# EAGLE design antares (EAGLE 4.16)
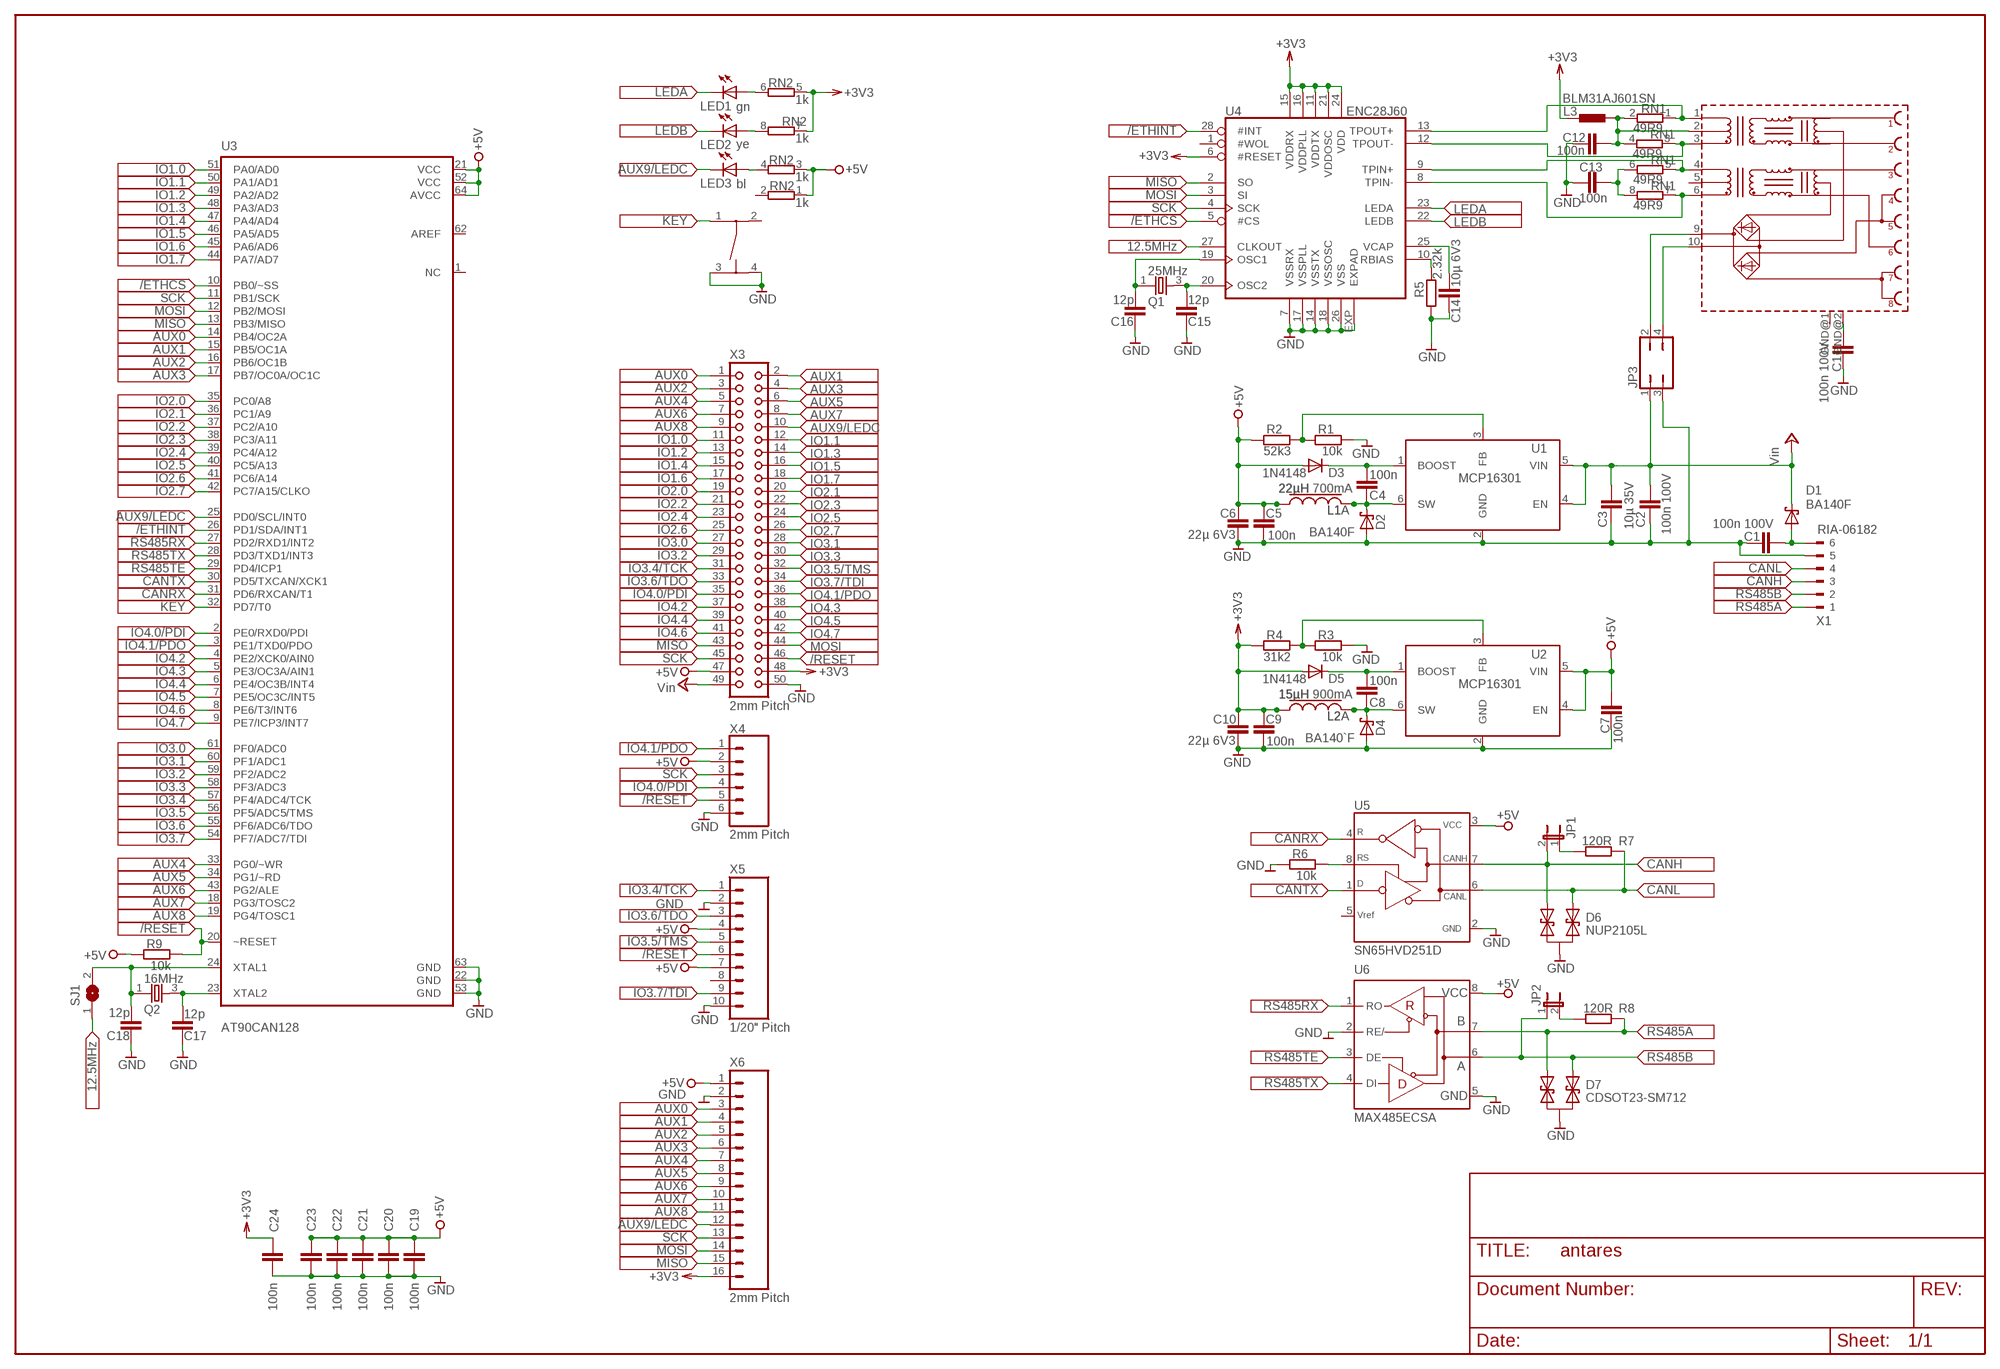
[diagram p0: schematic, sheet 1]

## Parts
C1  100n 100V  C-EUC1206  [C1206]
C2  100n 100V  C-EUC1206  [C1206]
C3  10µ 35V  C-EUC1210  [C1210]
C4  100n  C-EUC0603  [C0603]
C5  100n  C-EUC0603  [C0603]
C6  22µ 6V3  C-EUC0805  [C0805]
C7  100n  C-EUC0603  [C0603]
C8  100n  C-EUC0603  [C0603]
C9  100n  C-EUC0603  [C0603]
C10  22µ 6V3  C-EUC0805  [C0805]
C11  100n 100V  C-EUC1206  [C1206]
C12  100n  C-EUC0603  [C0603]
C13  100n  C-EUC0603  [C0603]
C14  10µ 6V3  C-EUC0603  [C0603]
C15  12p  C-EUC0603  [C0603]
C16  12p  C-EUC0603  [C0603]
C17  12p  C-EUC0603  [C0603]
C18  12p  C-EUC0603  [C0603]
C19  100n  C-EUC0603  [C0603]
C20  100n  C-EUC0603  [C0603]
C21  100n  C-EUC0603  [C0603]
C22  100n  C-EUC0603  [C0603]
C23  100n  C-EUC0603  [C0603]
C24  100n  C-EUC0603  [C0603]
D1  BA140F  SCHOTTKY-DIODESMA  [SMA]
D2  BA140F  SCHOTTKY-DIODESMA  [SMA]
D3  1N4148  DIODE-SOD323-R  [SOD323-R]
D4  BA140`F  SCHOTTKY-DIODESMA  [SMA]
D5  1N4148  DIODE-SOD323-R  [SOD323-R]
D6  NUP2105L  [SOT23]
D7  CDSOT23-SM712  NUP2105L  [SOT23]
JP1  JP1EI  [JP1]
JP2  JP1EI  [JP1]
JP3  JP2Q  [JP2Q]
L1  22µH 700mA  PISG  [PISG]
L1A  22µH  SRN3015  [SRN3015]
L2  15µH 900mA  PISG  [PISG]
L2A  15µH  SRN3015  [SRN3015]
L3  BLM31AJ601SN  L-EUL1206  [C1206K]
LED1  gn  LEDCHIP-LED0805  [CHIP-LED0805]
LED2  ye  LEDCHIP-LED0805  [CHIP-LED0805]
LED3  bl  LEDCHIP-LED0805  [CHIP-LED0805]
Q1  25MHz  QXO32  [XO32]
Q2  16MHz  QXO32  [XO32]
R1  10k  R-EU_R0603  [R0603]
R2  52k3  R-EU_R0603  [R0603]
R3  10k  R-EU_R0603  [R0603]
R4  31k2  R-EU_R0603  [R0603]
R5  2.32k  R-EU_R0603  [R0603]
R6  10k  R-EU_R0603  [R0603]
R7  120R  R-EU_R0603  [R0603]
R8  120R  R-EU_R0603  [R0603]
R9  10k  R-EU_R0603  [R0603]
RN1  49R9  E4RP  [BCN16]
RN2  1k  E4RP  [BCN16]
SJ1  SJN  [SJJ]
SW1  MENTOR1254PHAP3301  [PHAP3301]
U1  MCP16301  [SOT23-6L]
U2  MCP16301  [SOT23-6L]
U3  AT90CAN128  AT90CAN16AU  [TQFP64]
U4  ENC28J60  ENC28J60I/ML  [QNF28]
U5  SN65HVD251D  SN65HVD230DESA  [SO8]
U6  MAX485ECSA  MAX3072ECSA  [SO8]
X1  RIA-06182  [182-06]
X2  WE7499210001A-  [WE7499210001A]
X3  2mm Pitch  CON50F  [2MM-50DF]
X4  2mm Pitch  ML6M  [STL22-560LPGGG6]
X5  1/20" Pitch  ML1012C56  [12C56-010G]
X6  2mm Pitch  ML16STL560  [STL22-560LPGGG16]

## Nets
12.5MHZ: SJ1.1 U4.27(CLKOUT)
+3V3: C9.2 C10.2 C24.2 D5.A L2.2 L2A.1 L3.1 R4.2 RN2.5 RN2.7 U4.6(#RESET) U4.11(VDDTX) U4.15(VDDRX) U4.16(VDDPLL) U4.21(VDDOSC) U4.24(VDD) X3.48 X6.16
+5V [gnd-vcc]: C5.2 C6.2 C7.2 C19.2 C20.2 C21.2 C22.2 C23.2 D3.A L1.2 L1A.1 R2.2 R9.2 RN2.1 RN2.3 U2.4(EN) U2.5(VIN) U3.21(VCC) U3.52(VCC) U3.64(AVCC) U5.3(VCC) U6.8(VCC) X3.47 X4.2 X5.4 X5.7 X6.1
/ETHCS: U3.10(PB0/~SS) U4.5(#CS)
/ETHINT: U3.26(PD1/SDA/INT1) U4.28(#INT)
/RESET: R9.1 U3.20(~RESET) X3.46 X4.5 X5.6
AUX0: U3.14(PB4/OC2A) X3.1 X6.3
AUX1: U3.15(PB5/OC1A) X3.2 X6.4
AUX2: U3.16(PB6/OC1B) X3.3 X6.5
AUX3: U3.17(PB7/OC0A/OC1C) X3.4 X6.6
AUX4: U3.33(PG0/~WR) X3.5 X6.7
AUX5: U3.34(PG1/~RD) X3.6 X6.8
AUX6: U3.43(PG2/ALE) X3.7 X6.9
AUX7: U3.18(PG3/TOSC2) X3.8 X6.10
AUX8: U3.19(PG4/TOSC1) X3.9 X6.11
AUX9/LEDC: LED3.C U3.25(PD0/SCL/INT0) X3.10 X6.12
BST3: C8.2 D5.C U2.1(BOOST)
BST5: C4.2 D3.C U1.1(BOOST)
CANH: D6.1 JP1.2 U5.7(CANH) X1.3
CANL: D6.2 R7.2 U5.6(CANL) X1.4
CANRX: U3.31(PD6/RXCAN/T1) U5.4(R)
CANTX: U3.30(PD5/TXCAN/XCK1) U5.1(D)
FB3: R3.2 R4.1 U2.3(FB)
FB5: R1.2 R2.1 U1.3(FB)
GND: C1.1 C2.2 C3.1 C5.1 C6.1 C7.1 C9.1 C10.1 C11.1 C12.1 C13.1 C14.1 C15.1 C16.1 C17.1 C18.1 C19.1 C20.1 C21.1 C22.1 C23.1 C24.1 D2.A D4.A D6.3 D7.3 JP3.3 R1.1 R3.1 R5.1 R6.2 SW1.3(A) SW1.4(A) U1.2(GND) U2.2(GND) U3.22(GND) U3.53(GND) U3.63(GND) U4.7(VSSRX) U4.14(VSSTX) U4.17(VSSPLL) U4.18(VSSOSC) U4.26(VSS) U4.EXP(EXPAD) U5.2(GND) U6.2(RE/) U6.5(GND) X1.5 X3.50 X4.6 X5.2 X5.10 X6.2
IO1.0: U3.51(PA0/AD0) X3.11
IO1.1: U3.50(PA1/AD1) X3.12
IO1.2: U3.49(PA2/AD2) X3.13
IO1.3: U3.48(PA3/AD3) X3.14
IO1.4: U3.47(PA4/AD4) X3.15
IO1.5: U3.46(PA5/AD5) X3.16
IO1.6: U3.45(PA6/AD6) X3.17
IO1.7: U3.44(PA7/AD7) X3.18
IO2.0: U3.35(PC0/A8) X3.19
IO2.1: U3.36(PC1/A9) X3.20
IO2.2: U3.37(PC2/A10) X3.21
IO2.3: U3.38(PC3/A11) X3.22
IO2.4: U3.39(PC4/A12) X3.23
IO2.5: U3.40(PC5/A13) X3.24
IO2.6: U3.41(PC6/A14) X3.25
IO2.7: U3.42(PC7/A15/CLKO) X3.26
IO3.0: U3.61(PF0/ADC0) X3.27
IO3.1: U3.60(PF1/ADC1) X3.28
IO3.2: U3.59(PF2/ADC2) X3.29
IO3.3: U3.58(PF3/ADC3) X3.30
IO3.4/TCK: U3.57(PF4/ADC4/TCK) X3.31 X5.1
IO3.5/TMS: U3.56(PF5/ADC5/TMS) X3.32 X5.5
IO3.6/TDO: U3.55(PF6/ADC6/TDO) X3.33 X5.3
IO3.7/TDI: U3.54(PF7/ADC7/TDI) X3.34 X5.9
IO4.0/PDI: U3.2(PE0/RXD0/PDI) X3.35 X4.4
IO4.1/PDO: U3.3(PE1/TXD0/PDO) X3.36 X4.1
IO4.2: U3.4(PE2/XCK0/AIN0) X3.37
IO4.3: U3.5(PE3/OC3A/AIN1) X3.38
IO4.4: U3.6(PE4/OC3B/INT4) X3.39
IO4.5: U3.7(PE5/OC3C/INT5) X3.40
IO4.6: U3.8(PE6/T3/INT6) X3.41
IO4.7: U3.9(PE7/ICP3/INT7) X3.42
KEY: SW1.1(B) U3.32(PD7/T0)
LEDA: LED1.C U4.23(LEDA)
LEDB: LED2.C U4.22(LEDB)
MISO: U3.13(PB3/MISO) U4.2(SO) X3.43 X6.15
MOSI: U3.12(PB2/MOSI) U4.3(SI) X3.44 X6.14
N$4: LED3.A RN2.4
N$7: C12.2 L3.2 RN1.2 RN1.4 X2.2(TCT)
N$8: C13.2 RN1.6 RN1.8
N$23: R6.1 U5.8(RS)
N$24: JP1.1 R7.1
N$25: LED1.A RN2.6
N$26: JP2.2 R8.1
N$29: LED2.A RN2.8
OSC1: C16.2 Q1.1 U4.19(OSC1)
OSC2: C15.2 Q1.3 U4.20(OSC2)
RBIAS: R5.2 U4.10(RBIAS)
RS485A: D7.1 R8.2 U6.7(B) X1.1
RS485B: D7.2 JP2.1 U6.6(A) X1.2
RS485RX: U3.27(PD2/RXD1/INT2) U6.1(RO)
RS485TE: U3.29(PD4/ICP1) U6.3(DE)
RS485TX: U3.28(PD3/TXD1/INT3) U6.4(DI)
SCK: U3.11(PB1/SCK) U4.4(SCK) X3.45 X4.3 X6.13
SHLD: C11.2 X2.GND@2(SHLD)
SW3: C8.1 D4.C L2.1 L2A.2 U2.6(SW)
SW5: C4.1 D2.C L1.1 L1A.2 U1.6(SW)
TPIN+: RN1.5 U4.9(TPIN+) X2.4(RX+)
TPIN-: RN1.7 U4.8(TPIN-) X2.6(RX-)
TPOUT+: RN1.1 U4.13(TPOUT+) X2.1(TX+)
TPOUT-: RN1.3 U4.12(TPOUT-) X2.3(TX-)
VCAP: C14.2 U4.25(VCAP)
VETH+: JP3.2 X2.9(VC1+)
VETH-: JP3.4 X2.10(VC1-)
VIN [power]: C2.1 C3.2 D1.C JP3.1 U1.4(EN) U1.5(VIN) X3.49 ; supply symbol labelled Vin
VSUP [power]: C1.2 D1.A X1.6
XTAL1: C18.2 Q2.1 SJ1.2 U3.24(XTAL1)
XTAL2: C17.2 Q2.3 U3.23(XTAL2)
Unconnected: RN2.2 SW1.2(B) U3.1(NC) U3.62(AREF) U4.1(#WOL) U5.5(VREF) X2.5(RCT) X2.GND@1(SHLD) X5.8

## Library data of the parts
C1-C24 = rcl:C-EU: CAPACITOR, European symbol
D1 D2 D4 = diode:SCHOTTKY-DIODE: Schottky Diode
D3 D5 = diode:DIODE-: DIODE
D6 D7 = _frank:NUP2105L
JP1 JP2 = jumper:JP1E: JUMPER
JP3 = jumper:JP2Q: JUMPER
L1 L2 = inductor-fastron:PI
L1A L2A = inductor-bourns:SRN
L3 = rcl:L-EU: INDUCTOR, European symbol
LED1-LED3 = led:LED: LED OSRAM: - CHIPLED LG R971, LG N971, LY N971, LG Q971, LY Q971, LO R971, LY R971 LH N974, LH R974 LS Q976, LO Q976, LY Q976 LO Q996 - Hyper CHIPLED LW Q18S LB Q993, LB Q99A, LB R99A - SideLED LS A670, LO A670, LY A670, LG A670, LP A670 LB A673, LV A673, LT A673, LW A673 LH A674 LY A675 LS A676, LA A676, LO A676, LY A676, LW A676 LS A679, LY A679, LG A679 - Hyper Micro SIDELED® LS Y876, LA Y876, LO Y876, LY Y876 LT Y87S - SmartLED LW L88C, LW L88S LB L89C, LB L89S, LG L890 LS L89K, LO L89K, LY L89K LS L896, LA L896, LO L896, LY L896 - TOPLED LS T670, LO T670, LY T670, LG T670, LP T670 LSG T670, LSP T670, LSY T670, LOP T670, LYG T670 LG T671, LOG T671, LSG T671 LB T673, LV T673, LT T673, LW T673 LH T674 LS T676, LA T676, LO T676, LY T676, LB T676, LH T676, LSB T676, LW T676 LB T67C, LV T67C, LT T67C, LS T67K, LO T67K, LY T67K, LW E67C LS E67B, LA E67B, LO E67B, LY E67B, LB E67C, LV E67C, LT E67C LW T67C LS T679, LY T679, LG T679 LS T770, LO T770, LY T770, LG T770, LP T770 LB T773, LV T773, LT T773, LW T773 LH T774 LS E675, LA E675, LY E675, LS T675 LS T776, LA T776, LO T776, LY T776, LB T776 LHGB T686 LT T68C, LB T68C - Hyper Mini TOPLED® LB M676 - Mini TOPLED Santana® LG M470 LS M47K, LO M47K, LY M47K Source: http://www.osram.convergy.de - LUMILED® LXK2-PW12-R00, LXK2-PW12-S00, LXK2-PW14-U00, LXK2-PW14-V00 LXK2-PM12-R00, LXK2-PM12-S00, LXK2-PM14-U00 LXK2-PE12-Q00, LXK2-PE12-R00, LXK2-PE12-S00, LXK2-PE14-T00, LXK2-PE14-U00 LXK2-PB12-K00, LXK2-PB12-L00, LXK2-PB12-M00, LXK2-PB14-N00, LXK2-PB14-P00, LXK2-PB14-Q00 LXK2-PR12-L00, LXK2-PR12-M00, LXK2-PR14-Q00, LXK2-PR14-R00 LXK2-PD12-Q00, LXK2-PD12-R00, LXK2-PD12-S00 LXK2-PH12-R00, LXK2-PH12-S00 LXK2-PL12-P00, LXK2-PL12-Q00, LXK2-PL12-R00 Source: www.luxeon.com
Q1 Q2 = _frank:Q: CRYSTAL
R1-R9 = rcl:R-EU_: RESISTOR, European symbol
RN1 RN2 = _frank:E4RP: SIL RESISTOR
SJ1 = jumper:SJ: SMD solder JUMPER
SW1 = switch:MENTOR1254
U1 U2 = _frank:MCP16301
U3 = AT90CAN:AT90CAN
U4 = ENC28J60:ENC28J60
U5 = _frank:SN65HVD230D: CANBUS TRANSEIVER
U6 = _frank:MAX3072E
X1 = con-ria:RIA-06
X2 = _frank:WE7499210001A
X3 = con-2mm-dual:CON50: CONNECTOR
X4 = con-harting-ml:ML6: HARTING
X5 = con-harting-ml:ML10: HARTING
X6 = con-harting-ml:ML16: HARTING

## Net classes
0 default: width 0.15 mm, drill 0.15 mm, clearance 0.3 mm
1 power: width 0.15 mm, drill 0.5 mm, clearance 0.3 mm
2 gnd-vcc: width 0.15 mm, drill 0.15 mm, clearance 0.3 mm

## Board
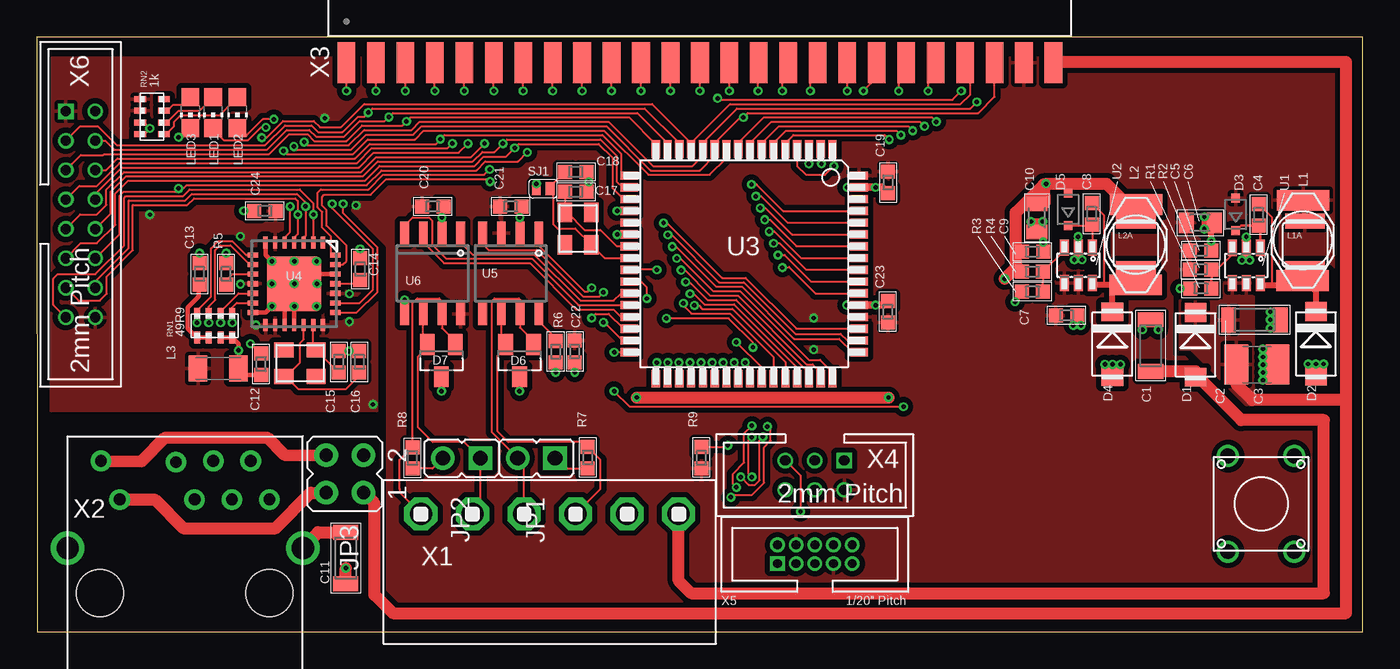
[diagram p1: board, top side]
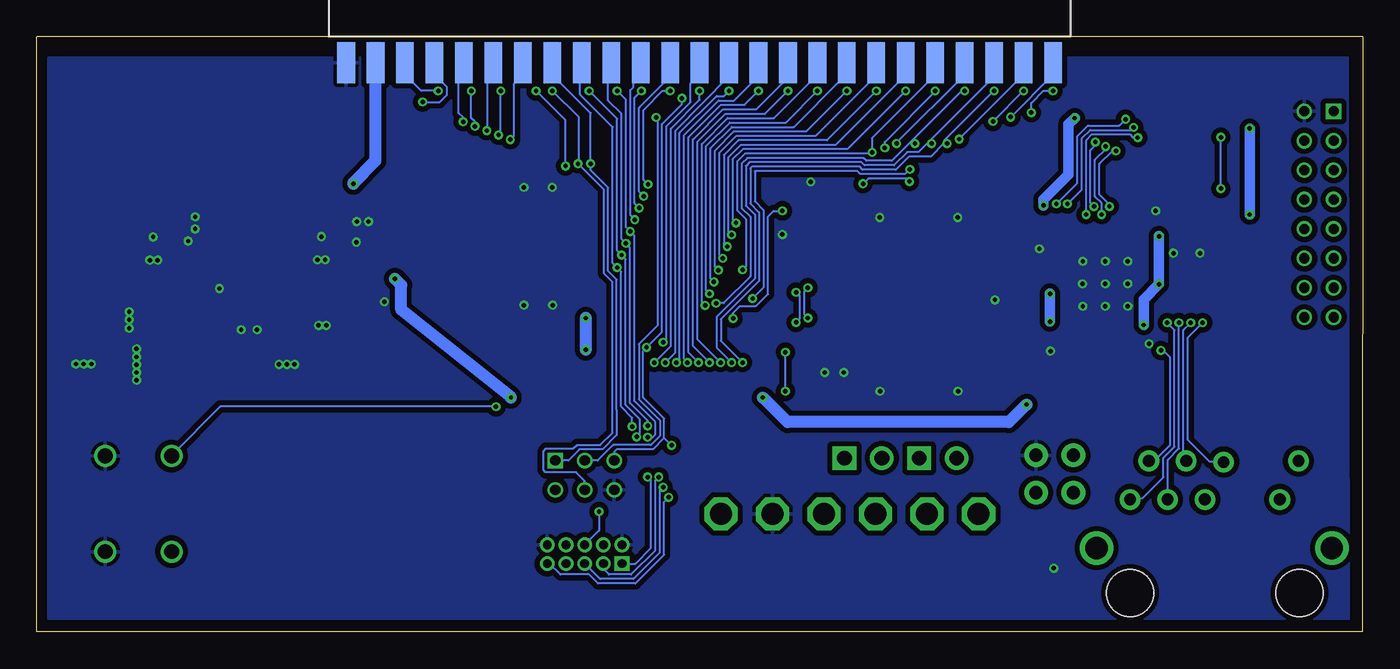
[diagram p2: board, bottom side, seen from below]

Size 90.03 x 40.42 mm. Coordinates in mm from the lower left corner, seen from the top.
Outline: 0.03,0 90.03,0 90.03,40.42 0,40.42 0.03,0
Copper layers (1*16): Top 0.035mm / dielectric 1.5mm / Bottom 0.035mm
Design rules "default": minimum track width 0.15mm, minimum drill 0.3mm, track to track 0.15mm, track to pad 0.15mm, pad to pad 0.15mm, via to via 0.15mm, smd to smd 0mil, copper to edge 0.35mm, drill to drill 8mil, minimum pad ring 0.15mm, minimum via ring 0.15mm, stop-mask expansion 0.15mm, vias tented up to drill 0.4mm, thermal gap 10mil

### Footprints (pad centres in the part's own frame; a part is rotated, then mirrored left to right if it is on the bottom)
C1206 = smd 1 x 1.7: 1 -1.75,0; 2 1.75,0
C1210 = smd 1.6 x 2.7: 1 -1.4,0; 2 1.4,0
C0603 = smd 0.95 x 0.95: 1 -0.731,0; 2 0.731,0
C0805 = smd 1 x 1.4: 1 -0.95,0; 2 0.95,0
SMA = smd 1.27 x 1.473: A 2.2,0; C -2.2,0
SOD323-R = smd 0.6 x 0.6: A 1.1,0; C -1.1,0
SOT23 = smd 1 x 1.4: 1 -0.95,-1.1; 2 0.95,-1.1; 3 0,1.1
JP1 = drill 1 pad 1.6 square: 1 0,-1.27 | drill 1 pad 1.6 round: 2 0,1.27
JP2Q = drill 0.9 pad 1.6 round: 1 -1.27,-1.27; 2 -1.27,1.27; 3 1.27,-1.27; 4 1.27,1.27
PISG = smd 1.4 x 3.56: 1 -2.729,0.01; 2 2.729,-0.03
SRN3015 = smd 2.7 x 1: 1 0,1.6; 2 0,-1.6
C1206K = smd 1.25 x 1.75: 1 -1.375,0; 2 1.375,0
CHIP-LED0805 = smd 1.2 x 1.2: A 0,-1.05; C 0,1.05
XO32 = smd 1.3 x 1: 1 -1.1,-0.9; 2 1.1,-0.9; 3 1.1,0.9; 4 -1.1,0.9
R0603 = smd 0.95 x 0.95: 1 -0.725,0; 2 0.725,0
BCN16 = smd 0.4 x 0.8: 1 -1.2,-0.8; 2 -1.2,0.8; 3 -0.4,-0.8; 4 -0.4,0.8; 5 0.4,-0.8; 6 0.4,0.8; 7 1.2,-0.8; 8 1.2,0.8
SJJ = smd 0.6 x 0.9: 1 -0.462,0; 2 0.462,0
PHAP3301 = drill 1 pad 1.4 round: 1 -3.25,-2.25; 2 3.25,-2.25; 3 -3.25,2.25; 4 3.25,2.25
SOT23-6L = smd 0.6 x 1.1: 1 -0.95,-1.2; 2 0,-1.2; 3 0.95,-1.2; 4 0.95,1.2; 5 0,1.2; 6 -0.95,1.2
TQFP64 = smd 1.2 x 0.56: 1 -7.8,6; 2 -7.8,5.2; 3 -7.8,4.4; 4 -7.8,3.6; 5 -7.8,2.8; 6 -7.8,2; 7 -7.8,1.2; 8 -7.8,0.4; 9 -7.8,-0.4; 10 -7.8,-1.2; 11 -7.8,-2; 12 -7.8,-2.8; 13 -7.8,-3.6; 14 -7.8,-4.4; 15 -7.8,-5.2; 16 -7.8,-6; 33 7.8,-6; 34 7.8,-5.2; 35 7.8,-4.4; 36 7.8,-3.6; 37 7.8,-2.8; 38 7.8,-2; 39 7.8,-1.2; 40 7.8,-0.4; 41 7.8,0.4; 42 7.8,1.2; 43 7.8,2; 44 7.8,2.8; 45 7.8,3.6; 46 7.8,4.4; 47 7.8,5.2; 48 7.8,6 | smd 0.56 x 1.2: 17 -6,-7.8; 18 -5.2,-7.8; 19 -4.4,-7.8; 20 -3.6,-7.8; 21 -2.8,-7.8; 22 -2,-7.8; 23 -1.2,-7.8; 24 -0.4,-7.8; 25 0.4,-7.8; 26 1.2,-7.8; 27 2,-7.8; 28 2.8,-7.8; 29 3.6,-7.8; 30 4.4,-7.8; 31 5.2,-7.8; 32 6,-7.8; 49 6,7.8; 50 5.2,7.8; 51 4.4,7.8; 52 3.6,7.8; 53 2.8,7.8; 54 2,7.8; 55 1.2,7.8; 56 0.4,7.8; 57 -0.4,7.8; 58 -1.2,7.8; 59 -2,7.8; 60 -2.8,7.8; 61 -3.6,7.8; 62 -4.4,7.8; 63 -5.2,7.8; 64 -6,7.8
QNF28 = smd 0.8 x 0.35: 1 -2.8,1.95; 2 -2.8,1.3; 3 -2.8,0.65; 4 -2.8,0; 5 -2.8,-0.65; 6 -2.8,-1.3; 7 -2.8,-1.95; 15 2.8,-1.95; 16 2.8,-1.3; 17 2.8,-0.65; 18 2.8,0; 19 2.8,0.65; 20 2.8,1.3; 21 2.8,1.95 | smd 0.35 x 0.8: 8 -1.95,-2.8; 9 -1.3,-2.8; 10 -0.65,-2.8; 11 0,-2.8; 12 0.65,-2.8; 13 1.3,-2.8; 14 1.95,-2.8; 22 1.95,2.8; 23 1.3,2.8; 24 0.65,2.8; 25 0,2.8; 26 -0.65,2.8; 27 -1.3,2.8; 28 -1.95,2.8 | smd 3.7 x 3.7: EXP 0,0
SO8 = smd 0.6 x 1.5: 1 -1.905,-2.759; 2 -0.635,-2.759; 3 0.635,-2.759; 4 1.905,-2.759; 5 1.905,2.759; 6 0.635,2.759; 7 -0.635,2.759; 8 -1.905,2.759
182-06 = drill 1.5 pad 2 octagon: 1 -8.75,0; 2 -5.25,0; 3 -1.75,0; 4 1.75,0; 5 5.25,0; 6 8.75,0
WE7499210001A = drill 0.8 pad 1.4 round: 1 5.715,6.35; 2 4.445,8.97; 3 3.175,6.35; 4 1.905,8.97; 5 0.635,6.35; 6 -0.635,8.89; 9 -4.445,6.35; 10 -5.715,8.97 | drill 1.5 round: GND@1 -7.99,3.046; GND@2 7.99,3.046 | hole 3.2: 5.715,0.001; -5.794,0.001
2MM-50DF = smd 2.8 x 1.2: 1 -6.1,24; 3 -6.1,22; 5 -6.1,20; 7 -6.1,18; 9 -6.1,16; 11 -6.1,14; 13 -6.1,12; 15 -6.1,10; 17 -6.1,8; 19 -6.1,6; 21 -6.1,4; 23 -6.1,2; 25 -6.1,0; 27 -6.1,-2; 29 -6.1,-4; 31 -6.1,-6; 33 -6.1,-8; 35 -6.1,-10; 37 -6.1,-12; 39 -6.1,-14; 41 -6.1,-16; 43 -6.1,-18; 45 -6.1,-20; 47 -6.1,-22; 49 -6.1,-24 | smd 2.8 x 1.2 bottom: 2 -6.1,24; 4 -6.1,22; 6 -6.1,20; 8 -6.1,18; 10 -6.1,16; 12 -6.1,14; 14 -6.1,12; 16 -6.1,10; 18 -6.1,8; 20 -6.1,6; 22 -6.1,4; 24 -6.1,2; 26 -6.1,0; 28 -6.1,-2; 30 -6.1,-4; 32 -6.1,-6; 34 -6.1,-8; 36 -6.1,-10; 38 -6.1,-12; 40 -6.1,-14; 42 -6.1,-16; 44 -6.1,-18; 46 -6.1,-20; 48 -6.1,-22; 50 -6.1,-24
STL22-560LPGGG6 = drill 0.7 square: 1 -2,-1 | drill 0.7 round: 2 -2,1; 3 0,-1; 4 0,1; 5 2,-1; 6 2,1
12C56-010G = drill 0.6 pad 1 square: 1 -2.54,-0.635 | drill 0.6 pad 1 round: 2 -2.54,0.635; 3 -1.27,-0.635; 4 -1.27,0.635; 5 0,-0.635; 6 0,0.635; 7 1.27,-0.635; 8 1.27,0.635; 9 2.54,-0.635; 10 2.54,0.635
STL22-560LPGGG16 = drill 0.7 square: 1 -7,-1 | drill 0.7 round: 2 -7,1; 3 -5,-1; 4 -5,1; 5 -3,-1; 6 -3,1; 7 -1,-1; 8 -1,1; 9 1,-1; 10 1,1; 11 3,-1; 12 3,1; 13 5,-1; 14 5,1; 15 7,-1; 16 7,1

### Placement (x,y rotation side)
C1  75.62,19.45 270 top
C2  82.68,21.2 0 top
C3  82.84,18.16 180 top
C4  82.96,28.34 270 top
C5  79.03,25.9 180 top
C6  79,27.79 180 top
C7  69.92,21.5 180 top
C8  71.62,28.4 270 top
C9  67.6,25.82 180 top
C10  67.9,28.12 90 top
C11  20.97,5.02 90 top
C12  15.22,18.2 270 top
C13  11.05,24.32 270 top
C14  21.95,24.65 270 top
C15  20.5,18.35 270 top
C16  21.9,18.35 270 top
C17  36.6,29.9 180 top
C18  36.6,31.25 180 top
C19  57.8,30.52 90 top
C20  26.88,28.9 180 top
C21  32.17,28.9 180 top
C22  36.52,19.05 90 top
C23  57.77,21.75 270 top
C24  15.49,28.6 0 top
D1  78.68,19.5 270 top
D2  86.86,19.57 270 top
D3  81.4,28.36 90 top
D4  73.03,19.55 270 top
D5  70.03,28.7 90 top
D6  32.77,18.43 180 top
D7  27.47,18.43 180 top
JP1  33.92,11.81 90 top
JP2  28.84,11.81 90 top
JP3  20.91,10.73 90 top
L1  85.96,26.6 90 top
L1A  86.11,26.3 0 top
L2  74.62,26.3 90 top
L2A  74.62,26.3 0 top
L3  12.33,17.9 0 top
LED1  11.97,35.27 180 top
LED2  13.62,35.27 180 top
LED3  10.43,35.27 180 top
Q1  17.88,18.25 0 top
Q2  36.75,27.4 90 top
R1  79.04,23.33 0 top
R2  79.02,24.62 180 top
R3  67.6,23.12 0 top
R4  67.6,24.48 180 top
R5  12.85,24.32 270 top
R6  35.23,19.04 270 top
R7  37.4,11.85 90 top
R8  25.5,11.82 90 top
R9  45.12,11.84 270 top
RN1  12.08,20.8 180 top
RN2  7.83,35 270 top
SJ1  34.38,30.12 0 top
SW1  83.12,8.7 270 top
U1  82.12,24.89 180 top
U2  70.73,24.9 180 top
U3  48.02,25 270 top
U4  17.47,23.65 270 top
U5  32.17,24.35 180 top
U6  26.88,24.35 180 top
X1  34.83,8.01 0 top
X2  10.08,2.65 0 top
X3  45.02,44.76 90 top
X4  52.82,10.65 180 top
X5  52.82,5.28 0 top
X6  2.96,28.37 270 top

### Tracks (layer width: path | path; a pad name or v marks a point on that pad's centre or on a via)
12.5MHZ  (via drill 0.3)
  Top 0.15: U4.27 20.77,24.95 21.02,25.2 21.02,26.25 19.67,27.6 19.67,28.65 19.38,28.95 19.38,29.55 19.52,29.7 22.67,29.7 23.72,30.75 30.62,30.75 v30.77,30.6 | SJ1.1 33.91,30.14 33.92,30.15 v33.92,30.45
  Bottom 0.15: v30.77,30.6 30.97,30.8 33.57,30.8 v33.92,30.45
+3V3  (via drill 0.3 pad 0.6)
  Top 0.15: 70.03,30.45 D5.A | RN2.5 7.33,34.6 v7.68,34.2 7.33,33.8 RN2.7 | L2.2 74.65,27.91 L2A.1
  Top 0.8: L2.2 74.05,29.03 72.62,30.45 70.03,30.45 68.65,30.45 67.3,29.1 C10.2 68.4,29.07 68.38,30.4 | 68.38,30.4 66.48,28.5 66.48,25.82 | 66.48,25.82 66.48,24.88 R4.2 66.2,24.48 v65.73,24 | 66.48,25.82 C9.2 | 68.38,30.4 v68.53,30.45 | v40.73,15.93 v57.82,15.93
  Bottom 0.7: v14.88,20.85 14.88,22.57 v13.83,23.62 v13.83,26.88 | v7.68,28.35 v7.68,34.2 | v21.22,21.07 v21.22,22.98
  Bottom 0.8: v68.53,30.45 68.53,30.5 67.03,32 X3.48 | v40.73,15.93 39.05,14.25 24.02,14.25 v22.82,15.45 | v57.82,15.93 57.82,15.95 65.28,21.9 65.28,23.55 v65.73,24
  pour Top (isolate 0.35, rank 4): 0.93,15 23.12,15 23.12,25.65 18.77,30 7.53,30 1.57,24 0.97,24
+5V  (via drill 0.3, 0.3 pad 0.6)
  Bottom 0.7: v21.67,28.98 21.67,29.35 19.97,31.05 19.97,34.48 v19.55,34.9
  Bottom 0.8: v52.75,19.18 v52.75,21.32
  pour Top (isolate 0.35, rank 6): 89.28,0.9 89.28,39 0.97,39 0.97,24 5.33,24 11.28,30 19.97,30 23.75,26.2 23.75,0.9
/ETHCS  (via drill 0.3 pad 0.6)
  Top 0.15: U3.10 46.82,32.2 45.67,31.05 41.52,31.05 38.52,34.05 26.27,34.05 25.67,33.45 22.47,33.45 21.47,32.45 16.97,32.45 v16.75,32.67 | v17.2,28.9 17.2,27.15 16.82,26.77 U4.5
  Bottom 0.15: v16.75,32.67 17,32.67 17.88,31.8 17.88,29.7 17.2,29.02 v17.2,28.9
/ETHINT  (via drill 0.3 pad 0.6)
  Top 0.15: U3.26 41.02,23.8 41.42,23.4 v41.42,22.65 | U4.28 19.97,25.6 19.97,26.85 19.38,27.45 19.38,28.52 19.07,28.82 19.07,29.85 19.27,30.05 22.52,30.05 23.52,31.05 30.38,31.05 v30.75,31.43
  Bottom 0.15: v41.42,22.65 40.67,23.4 40.67,28.65 41.27,29.25 41.27,31.3 34.3,31.3 34.1,31.1 31.07,31.1 v30.75,31.43
/RESET  (via drill 0.3 pad 0.6)
  Top 0.15: v62.77,36.75 62.17,36.15 46.23,36.15 v46.23,36.25 | X4.5 51.85,10.62 v51.85,8.18 | R9.1 46.82,12.57 v46.92,12.68 | v39.4,28.6 U3.20 | v42.75,21.3 46.98,21.3 48.62,19.65 v48.62,19.32
  Bottom 0.15: v46.23,36.25 46.23,35.85 47.57,34.5 47.57,20.38 48.85,19.1 | v62.77,36.75 63.92,36.75 65.03,37.85 X3.46 | X4.5 50.82,12.22 50.65,12.4 48.2,12.4 47.42,13.18 | 47.42,13.18 47.42,14.5 48.85,15.93 48.85,19.1 | X5.6 52.82,5.92 51.85,6.9 v51.85,8.18 | v46.92,12.68 47.42,13.18 | v39.4,28.6 40,28.6 40.38,28.23 40.38,22.95 41.2,22.12 42.27,22.12 42.75,21.65 v42.75,21.3 | 48.85,19.1 v48.62,19.32
AUX0  (via drill 0.3 pad 0.6)
  Top 0.15: U3.14 43.62,33.2 41.27,35.55 22.77,35.55 v22.5,35.27 22.22,35 21.8,35 20.75,33.95 19.1,33.95 18.65,34.4 16.85,34.4 15.5,33.05 5.43,33.05 4.12,34.35 2.94,34.35 X6.3 | v21.02,36.75 X3.1
  Bottom 0.15: v22.5,35.27 22.5,35.92 21.67,36.75 v21.02,36.75
AUX1  (via drill 0.3 pad 0.6)
  Top 0.15: U3.15 42.82,33.2 40.77,35.25 24.17,35.25 v23.9,34.98 23.62,34.7 21.92,34.7 20.88,33.65 18.95,33.65 18.5,34.1 16.97,34.1 15.62,32.75 5.25,32.75 4.65,33.37 X6.4
  Bottom 0.15: X3.2 21.02,37.85 v23.9,34.98
AUX2  (via drill 0.3 pad 0.6)
  Top 0.15: U3.16 42.02,33.15 40.23,34.95 25.38,34.95 v25.1,34.67 24.82,34.4 22.07,34.4 21.02,33.35 18.82,33.35 18.38,33.8 17.12,33.8 15.78,32.45 4.58,32.45 4.53,32.4 3,32.4 X6.5 | v23.02,36.75 X3.3
  Bottom 0.15: v25.1,34.67 v23.02,36.75
AUX3  (via drill 0.3 pad 0.6)
  Top 0.15: U3.17 39.88,31 39.67,31.2 39.67,32.48 38.4,33.75 27.67,33.75 v27.4,33.48 27.42,33.48 27.1,33.15 22.6,33.15 21.6,32.15 5.48,32.15 4.7,31.37 X6.6
  Bottom 0.15: X3.4 23.02,37.85 v27.4,33.48
AUX4  (via drill 0.3 pad 0.6)
  Top 0.15: v42.1,18.3 42.02,18.23 U3.33 | v25.02,36.75 X3.5 | v28.22,33.17 27.88,32.85 22.72,32.85 21.75,31.85 5.62,31.85 4.08,30.3 2.9,30.3 X6.7
  Bottom 0.15: v42.1,18.3 43.57,19.77 43.57,21.25 40.98,23.85 40.98,28.5 41.57,29.1 41.57,31.5 41.48,31.6 34.15,31.6 33.95,31.4 31.7,31.4 30.8,32.3 29.32,32.3 28.4,33.23 | 28.4,33.23 28.3,33.12 v28.22,33.17 | v25.02,36.75 28.4,33.4 28.4,33.23
AUX5  (via drill 0.3 pad 0.6)
  Top 0.15: v42.85,18.3 42.82,18.27 U3.34 | v29.27,33.17 28.65,32.55 22.88,32.55 21.88,31.55 5.78,31.55 3.59,29.37 X6.8
  Bottom 0.15: v42.85,18.3 43.88,19.32 43.88,21.4 41.27,24 41.27,28.35 41.88,28.95 41.88,31.65 41.62,31.9 34.02,31.9 33.82,31.7 31.82,31.7 30.92,32.6 30.15,32.6 29.42,33.33 | 25.02,37.73 X3.6 | v29.27,33.17 29.42,33.33 | 25.02,37.73 25.02,37.7 | 29.42,33.33 25.02,37.73
AUX6  (via drill 0.3 pad 0.6)
  Top 0.15: U3.43 50.02,18.68 47.07,21.62 44.45,21.62 43.9,22.18 v43.9,22.32 | v27.02,36.75 X3.7 | v30.4,33.17 29.47,32.25 23.02,32.25 22.02,31.25 5.93,31.25 4.73,30.05 4.73,29 4.08,28.35 2.94,28.35 X6.9
  Bottom 0.15: v43.9,22.32 43.4,22.32 41.57,24.15 41.57,28.2 42.17,28.8 42.17,31.8 41.77,32.2 33.9,32.2 33.7,32 31.97,32 30.6,33.38 | 30.6,33.38 27.22,36.75 v27.02,36.75 | v30.4,33.17 30.6,33.38
AUX7  (via drill 0.3 pad 0.6)
  Top 0.15: U3.18 39.77,30.2 39.38,30.6 39.38,32.35 38.27,33.45 31.92,33.45 v31.65,33.17 31.07,32.6 30.25,32.6 29.6,31.95 23.15,31.95 22.15,30.95 6.08,30.95 5.03,29.9 5.03,28.43 X6.10
  Bottom 0.15: X3.8 27.02,37.85 31.65,33.23 v31.65,33.17
AUX8  (via drill 0.3 pad 0.6)
  Top 0.15: U3.19 39.82,29.4 39.07,30.15 39.07,32.23 38.15,33.15 32.73,33.15 v32.45,32.88 31.85,32.27 30.35,32.27 29.72,31.65 23.27,31.65 22.27,30.65 6.2,30.65 5.33,29.77 5.33,27.65 4.08,26.4 3,26.4 X6.11 | v29.02,36.75 X3.9
  Bottom 0.15: v32.45,32.88 32.45,33.27 28.97,36.75 v29.02,36.75
AUX9/LEDC  (via drill 0.3 pad 0.6)
  Top 0.15: v42.1,24.6 U3.25 | v33.3,32.58 32.67,31.95 30.45,31.95 29.85,31.35 23.4,31.35 22.4,30.35 10.18,30.35 9.97,30.15 | 9.97,30.15 9.72,29.9 5.9,29.9 5.62,29.62 5.62,27.03 X6.12 | LED3.C 10.25,34.23 v9.62,33.6 | 9.97,30.15 9.78,29.98 v9.62,30.12
  Bottom 0.15: X3.10 29.52,38.16 29.52,37.35 33.3,33.58 v33.3,32.58 | v33.3,32.58 33.38,32.5 41.92,32.5 42.48,31.95 42.48,28.65 41.88,28.05 41.88,24.82 v42.1,24.6 | v33.3,32.58 33.3,32.83 | v9.62,30.12 v9.62,33.6
BST3
  Top 0.15: D5.C 71.62,27.6 C8.2 71.68,27.62 U2.1
BST5
  Top 0.16: U1.1 83.07,27.51 82.97,27.61 C4.2 81.78,27.61 81.43,27.25 81.42,27.26 D3.C
CANH
  Top 0.15: D6.1 33.73,19.75 32.81,20.66 U5.7 32.8,22.57 32.73,22.65 31.07,22.65 30.92,22.5 30.92,13.55 32.65,11.82 | 32.65,11.82 JP1.2 | X1.3 33.08,11.39 32.65,11.82
CANL
  Top 0.15: U5.6 31.54,19.84 D6.2 31.82,19.32 31.27,18.77 31.27,13.62 32,12.9 37.08,12.9 R7.2 37.38,12.6 38.27,11.7 38.27,9.71 X1.4
CANRX  (via drill 0.3 pad 0.6)
  Top 0.15: U3.31 39.77,19.8 38.55,21.02 v38.48,21.02 | v38.48,23.07 38.2,22.8 37.07,22.8 33.92,25.95 30.67,25.95 30.27,26.36 U5.4
  Bottom 0.15: v38.48,21.02 38.25,21.25 38.25,22.85 v38.48,23.07
CANTX  (via drill 0.3 pad 0.6)
  Top 0.15: U3.30 39.82,20.6 38.82,21.6 37.95,21.6 v37.67,21.32 | v37.67,23.38 37.4,23.1 37.23,23.1 34.08,26.25 U5.1
  Bottom 0.15: v37.67,21.32 37.9,21.55 37.9,23.15 v37.67,23.38
FB3
  Top 0.15: R4.1 68.35,24.48 | R3.2 R4.1 | R4.1 69.78,25.92 U2.3
FB5
  Top 0.16: R1.2 79.77,24.56 79.73,24.6 R2.1 80.11,24.62 80.12,24.6 81.17,25.64 U1.3
GND  (via drill 0.3, 0.3 pad 0.6)
  Top 0.15: D2.A v86.85,18.2 | v70.7,26.85 70.73,26.82 U2.2 | v76.15,20.52 76.15,20.68 C1.1 | R5.1 v12.85,25.73 | C13.1 v11.05,25.73 | v21.2,19.08 C16.1 | C15.1 v21.2,19.08 | v21.2,19.08 v21.2,19.07 | C12.1 v14.5,19.57 | C14.1 v21.95,26.02 | U3.22 v39.4,27 | C17.1 37.48,29.9 v37.48,30.57 37.48,31.25 C18.1 | U6.5 v24.97,22.55 | 35.23,18.32 R6.2 v35.23,17.62 | C24.1 v14.05,28.6 | v36.52,17.62 C22.1
  Top 0.3: U4.EXP U4.18 | U4.7 15.53,25.6 U4.EXP | U4.26 18.12,24.3 U4.EXP | U4.17 16.82,23 U4.EXP | U4.14 15.53,21.7 U4.EXP
  Top 0.4: U1.2 | U1.2 v82.12,26.82 | v82.35,25.25 82.12,25.25 | 82.12,25.25 v81.83,25.25 | 82.12,25.25 U1.2 | v79.28,27.38 v79.28,28.2 79.95,28.2 C6.1 | C6.1 79.95,27.77 | C6.1 | 79.75,27.85 v79.75,26.55 v79.76,26.54 C5.1 | R1.1 78.3,23.32 v77.62,23.32 | v67.5,27.88 v68.3,27.88 67.9,27.48 C10.1 | C9.1 v68.33,26.48 | v66.43,22.43 R3.1 | v73.05,18.18 73.05,17.35 D4.A | C7.1 70.65,20.82 v70.38,20.82 | C3.1 | C3.1 | v83.25,18.15 C3.1 | v83.75,21.2 C2.2 | v70.98,25.27 70.73,25.27 U2.2 | D6.3 v32.77,16.35 | D7.3 v27.47,16.35 | U5.2 v32.8,28.15 32.8,28.79 C21.1 | U6.2 27.5,27.1 v27.5,28.15 27.5,28.79 C20.1 | C23.1
  Top 0.5: C19.1 57.39,30.2 v56.95,30.2 U3.63 | U3.53 v56.95,22.2 57.49,22.2 C23.1 | U3.53 v55,22.2 U3.53
  Top 0.8: C11.1 v20.97,4.33
  other vias: 17.47,23.65 15.95,22.12 15.95,23.65 15.95,25.18 17.47,25.18 19,25.18 19.02,23.65 19,22.12 17.47,22.12 86.33,18.2 87.38,18.2 70.45,25.27 75.08,20.52 72.53,18.18 73.58,18.18 70.9,20.82 83.25,17.1 83.25,17.62 83.25,18.68 83.25,19.23 83.75,20.62 83.75,21.75 55.02,30.2
  pour Bottom (isolate 0.35): 89.28,0.9 0.93,0.9 0.97,39 89.28,39
IO1.0  (via drill 0.3 pad 0.6)
  Top 0.15: U3.51 51.57,20.6 48.12,24.05 46.52,24.05 42.8,27.77 v42.55,27.77 | v31.02,36.75 X3.11
  Bottom 0.15: v42.55,27.77 42.77,28 42.77,32.1 42.07,32.8 34.98,32.8 v31.02,36.75
IO1.1  (via drill 0.3 pad 0.6)
  Top 0.15: U3.50 55.02,19.8 54.57,20.25 51.5,20.25 48,23.75 46.32,23.75 43.1,26.98 v42.85,26.98
  Bottom 0.15: v42.85,26.98 43.07,27.2 43.07,32.25 42.23,33.1 35.77,33.1 31.52,37.35 31.52,38.16 X3.12
IO1.2  (via drill 0.3 pad 0.6)
  Top 0.15: U3.49 55.38,19 54.48,19.9 51.42,19.9 47.88,23.45 46.12,23.45 43.4,26.18 v43.15,26.18 | v33.02,36.75 X3.13
  Bottom 0.15: v43.15,26.18 43.38,26.4 43.38,32.4 42.38,33.4 36.38,33.4 v33.02,36.75
IO1.3  (via drill 0.3 pad 0.6)
  Top 0.15: U3.48 54.02,17.62 53.17,18.48 52.42,18.48 47.75,23.15 45.92,23.15 43.7,25.38 v43.45,25.38
  Bottom 0.15: v43.45,25.38 43.67,25.6 43.67,32.55 42.52,33.7 37.12,33.7 33.48,37.35 33.48,38.21 X3.14
IO1.4  (via drill 0.3 pad 0.6)
  Top 0.15: U3.47 53.23,17.62 52.67,18.18 52.27,18.18 47.6,22.85 45.73,22.85 44,24.57 v43.75,24.57 | v35.02,36.75 X3.15
  Bottom 0.15: v43.75,24.57 43.98,24.8 43.98,32.7 42.67,34 37.77,34 v35.02,36.75
IO1.5  (via drill 0.3 pad 0.6)
  Top 0.15: U3.46 52.42,17.6 47.48,22.55 45.52,22.55 44.3,23.77 v44.05,23.77
  Bottom 0.15: v44.05,23.77 44.27,24 44.27,32.85 42.82,34.3 38.62,34.3 35.42,37.5 35.42,38.26 X3.16
IO1.6  (via drill 0.3 pad 0.6)
  Top 0.15: U3.45 51.62,17.98 47.35,22.25 45.32,22.25 44.6,22.98 v44.35,22.98 | v37.02,36.75 X3.17
  Bottom 0.15: v44.35,22.98 44.57,23.2 44.57,33 42.98,34.6 39.17,34.6 v37.02,36.75
IO1.7  (via drill 0.3 pad 0.6)
  Top 0.15: U3.44 50.82,18.35 47.23,21.95 45.17,21.95 44.95,22.18 v44.65,22.18
  Bottom 0.15: v44.65,22.18 44.88,22.4 44.88,33.15 43.12,34.9 39.98,34.9 37.52,37.35 37.52,38.16 X3.18
IO2.0  (via drill 0.3 pad 0.6)
  Top 0.15: U3.35 43.62,18.27 v43.6,18.3 | v39.02,36.75 X3.19
  Bottom 0.15: v43.6,18.3 45.17,19.88 45.17,33.3 43.27,35.2 40.57,35.2 v39.02,36.75
IO2.1  (via drill 0.3 pad 0.6)
  Top 0.15: U3.36 44.42,18.23 v44.35,18.3
  Bottom 0.15: v44.35,18.3 45.48,19.43 45.48,33.45 43.42,35.5 41.17,35.5 39.27,37.4 39.27,38.41 X3.20
IO2.2  (via drill 0.3 pad 0.6)
  Top 0.15: U3.37 45.23,18.18 v45.1,18.3 | v41.02,36.75 X3.21
  Bottom 0.15: v45.1,18.3 45.77,18.98 45.77,33.6 43.57,35.8 41.98,35.8 v41.02,36.75
IO2.3  (via drill 0.3 pad 0.6)
  Top 0.15: U3.38 46.02,18.12 v45.85,18.3
  Bottom 0.15: v45.85,18.3 46.07,18.52 46.07,33.75 43.73,36.1 42.67,36.1 41.38,37.4 41.38,38.31 X3.22
IO2.4  (via drill 0.3 pad 0.6)
  Top 0.15: U3.39 46.82,18.07 v46.6,18.3 | v43.02,36.75 X3.23
  Bottom 0.15: v46.6,18.3 46.38,18.52 46.38,33.9 43.88,36.4 43.38,36.4 v43.02,36.75
IO2.5  (via drill 0.3 pad 0.6)
  Top 0.15: U3.40 47.62,18.02 v47.35,18.3
  Bottom 0.15: v47.35,18.3 46.67,18.98 46.67,34.05 43.02,37.75 X3.24
IO2.6  (via drill 0.3 pad 0.6)
  Top 0.15: U3.41 48.4,18 v48.1,18.3 | v45.02,36.75 X3.25
  Bottom 0.15: v48.1,18.3 46.98,19.43 46.98,34.2 45.02,36.15 v45.02,36.75
IO2.7  (via drill 0.3 pad 0.6)
  Top 0.15: U3.42 49.23,17.95 v47.5,19.68
  Bottom 0.15: v47.5,19.68 47.27,19.9 47.27,34.35 45.62,36 45.62,37.26 45.02,37.85 X3.26
IO3.0  (via drill 0.3 pad 0.6)
  Top 0.15: U3.61 50.67,28.6 48.88,30.4 v48.52,30.4 | v47.02,36.75 X3.27
  Bottom 0.15: v48.52,30.4 48.82,30.7 48.82,35.45 47.52,36.75 v47.02,36.75
IO3.1  (via drill 0.3 pad 0.6)
  Top 0.15: U3.60 50.98,27.8 49.17,29.6 v48.82,29.6
  Bottom 0.15: v48.82,29.6 49.12,29.9 49.12,35.6 47.02,37.7 X3.28
IO3.2  (via drill 0.3 pad 0.6)
  Top 0.15: U3.59 51.27,27 49.48,28.8 v49.12,28.8 | v48.98,36.75 48.98,38.61 X3.29
  Bottom 0.15: v49.12,28.8 49.42,29.1 49.42,36.3 v48.98,36.75
IO3.3  (via drill 0.3 pad 0.6)
  Top 0.15: U3.58 51.57,26.2 49.77,28 v49.42,28
  Bottom 0.15: v49.42,28 49.73,28.3 49.73,36.8 49.52,37 49.52,38.15 X3.30
IO3.4/TCK  (via drill 0.3 pad 0.6)
  Top 0.15: U3.57 51.88,25.4 50.07,27.2 v49.73,27.2 | X3.31 50.62,38.25 v50.62,36.75 | v48.55,10.53 48.32,10.75 48.32,13.05 48.5,13.22 v48.55,13.22
  Bottom 0.15: v50.62,36.75 50.02,36.15 50.02,27.5 v49.73,27.2 49.45,26.93 49.45,15.68 48.02,14.25 48.02,13.43 48.23,13.22 v48.55,13.22 | X5.1 49.38,4.64 48.32,5.7 48.32,10.3 v48.55,10.53
IO3.5/TMS  (via drill 0.3 pad 0.6)
  Top 0.15: U3.56 52.23,24.6 50.42,26.4 v50.02,26.4 | v47.5,9.82 47.27,10.05 47.27,10.75 48.02,11.5 48.02,13.47 v48.55,14
  Bottom 0.15: X3.32 51.23,38.45 51.23,36.1 50.32,35.2 50.32,26.7 v50.02,26.4 49.75,26.12 49.75,15.55 48.55,14.35 v48.55,14 | X5.5 51.77,3.6 49.52,3.6 47.73,5.4 47.73,9.6 v47.5,9.82
IO3.6/TDO  (via drill 0.3 pad 0.6)
  Top 0.15: U3.55 52.57,23.8 50.77,25.6 v50.32,25.6 | X3.33 52.52,38.16 v52.52,36.75 | v47.8,10.53 48.32,10 48.77,10 49.07,10.3 49.07,13.03 v49.3,13.25
  Bottom 0.15: v52.52,36.75 50.62,34.85 50.62,25.9 v50.32,25.6 50.05,25.32 50.05,15.43 49.07,14.45 49.07,13.47 v49.3,13.25 | X5.3 51.55,4.28 51.17,3.9 49.67,3.9 48.02,5.55 48.02,10.3 v47.8,10.53
IO3.7/TDI  (via drill 0.3 pad 0.6)
  Top 0.15: U3.54 52.88,23 51.07,24.8 v50.62,24.75 | v47.12,9.15 47.27,9.3 48.55,9.3 49.38,10.12 49.38,12.55 49.82,13 49.82,13.72 v49.6,13.95
  Bottom 0.15: X3.34 53.12,38.56 53.12,36.5 50.92,34.3 50.92,25.05 v50.62,24.75 50.35,24.48 50.35,15.3 49.6,14.55 v49.6,13.95 | X5.9 55.21,4.64 54.48,3.9 52.52,3.9 51.92,3.3 49.38,3.3 47.42,5.25 47.42,8.85 v47.12,9.15
IO4.0/PDI  (via drill 0.3 pad 0.6)
  Top 0.15: v55.02,36.75 X3.35 | U3.2 53.23,31.85 v53.27,31.8
  Bottom 0.15: v55.02,36.75 53.23,34.95 53.23,31.85 v53.27,31.8 51.52,30.05 51.52,24.35 50.95,23.77 50.95,13.53 51.77,12.7 53.35,12.7 53.6,12.45 55.45,12.45 55.62,12.28 55.62,11 55.48,10.85 53.4,10.85 52.82,10.25 X4.4
IO4.1/PDO  (via drill 0.3 pad 0.6)
  Top 0.15: v52.42,31.8 U3.3
  Bottom 0.15: X3.36 55.02,37.85 52.42,35.25 v52.42,31.8 52.42,31.38 51.23,30.18 51.23,24.5 50.65,23.93 50.65,15.07 | X4.1 53.92,11.65 53.17,12.4 51.62,12.4 50.65,13.38 50.65,15.07 | 50.65,15.07 50.65,15.05
IO4.2  (via drill 0.3 pad 0.6)
  Top 0.15: v56.12,36.75 57.02,37.65 X3.37 | v54.12,31.65 53.52,31.05 52.23,31.05 51.62,31.65 U3.4
  Bottom 0.15: v56.12,36.75 54.12,34.75 v54.12,31.65
IO4.3  (via drill 0.3 pad 0.6)
  Top 0.15: U3.5 50.82,33.2 51.38,33.75 57.57,33.75 v57.88,33.45
  Bottom 0.15: v57.88,33.45 57.62,33.7 57.62,37.23 57.02,37.85 X3.38
IO4.4  (via drill 0.3 pad 0.6)
  Top 0.15: U3.6 50.02,33.2 50.88,34.05 58.38,34.05 v58.67,33.75 | X3.39 58.52,38.16 v58.52,36.75
  Bottom 0.15: v58.67,33.75 58.52,33.9 v58.52,36.75
IO4.5  (via drill 0.3 pad 0.6)
  Top 0.15: U3.7 49.23,33.2 50.38,34.35 59.17,34.35 v59.48,34.05
  Bottom 0.15: X3.40 59.42,38.26 59.42,34.1 v59.48,34.05
IO4.6  (via drill 0.3 pad 0.6)
  Top 0.15: U3.8 48.42,33.2 49.88,34.65 59.98,34.65 v60.27,34.35 | X3.41 60.52,38.16 v60.52,36.75
  Bottom 0.15: v60.27,34.35 60.27,34.65 60.52,34.9 v60.52,36.75
IO4.7  (via drill 0.3 pad 0.6)
  Top 0.15: U3.9 47.62,33.2 49.38,34.95 60.77,34.95 v61.07,34.65
  Bottom 0.15: X3.42 61.38,38.31 61.38,35.25 61.07,34.95 v61.07,34.65
KEY  (via drill 0.3 pad 0.6)
  Top 0.15: v39.2,19 U3.32 | v58.85,15.3 40.25,15.3 v39.2,16.35
  Bottom 0.15: v39.2,16.35 v39.2,19 | SW1.1 80.88,12 77.58,15.3 v58.85,15.3
LEDA  (via drill 0.3 pad 0.6)
  Top 0.15: U4.23 21.92,22.35 22.82,23.25 22.82,26 20.05,28.77 v20.05,29.07 | LED1.C 11.97,34.12 12.72,33.38 14.33,33.38 15.22,34.27 v15.55,34.27
  Bottom 0.15: v20.05,29.07 19.07,30.05 19.07,33.52 18.5,34.1 15.72,34.1 v15.55,34.27
LEDB  (via drill 0.3 pad 0.6)
  Top 0.15: U4.22 21.72,21.7 23.12,23.1 23.12,26.12 20.8,28.45 v20.8,29.07 | LED2.C 14.15,33.7 14.22,33.7 15.35,34.83 v16.1,34.83
  Bottom 0.15: v20.8,29.07 19.38,30.5 19.38,33.67 18.65,34.4 16.52,34.4 v16.1,34.83
MISO  (via drill 0.3 pad 0.6)
  Top 0.15: 44.42,33.2 41.77,35.85 22.22,35.85 20.65,34.27 19.22,34.27 18.8,34.7 16.72,34.7 15.6,33.58 v15.28,33.58 | 44.42,33.2 U3.13 | 44.42,33.2 47.07,35.85 62.73,35.85 63.38,36.5 63.38,37.25 63.02,37.6 X3.43 | U4.2 v18.77,28.35 18.77,29.12 17.85,30.05 10.38,30.05 9.93,29.6 6.05,29.6 5.93,29.48 5.93,26.25 3.98,24.3 1.42,24.3 1.12,24 1.12,22.21 X6.15
  Bottom 0.15: v18.77,28.35 18.77,33.4 18.38,33.8 15.83,33.8 15.6,33.58 v15.28,33.58
MOSI  (via drill 0.3 pad 0.6)
  Top 0.15: v63.82,36 63.38,35.55 47.52,35.55 45.23,33.25 U3.12 45.23,32.35 44.52,31.65 41.82,31.65 38.82,34.65 25.97,34.65 25.45,34.1 22.22,34.1 21.17,33.05 18.38,33.05 v18.15,33.27 | U4.3 18.12,26.77 18.25,26.9 v18.25,28.9 18.25,29.18 17.67,29.75 10.53,29.75 10.08,29.3 6.25,29.3 6.23,29.27 6.23,26.07 3.95,23.8 3.95,23.38 X6.14
  Bottom 0.15: X3.44 62.67,37.81 62.67,37.5 62.17,37 62.17,36.5 62.67,36 v63.82,36 | v18.25,28.9 18.47,29.12 18.47,32.73 18.15,33.05 v18.15,33.27
N$4
  Top 0.15: RN2.4 8.88,35.4 9.28,35.8 9.88,35.8 10.4,36.33 LED3.A
N$7  (via drill 0.3 pad 0.6)
  Top 0.15: RN1.2 13.28,19.98
  Top 0.3: C12.2 14.13,17.47 L3.2 v13.7,19.12 13.7,19.57 RN1.2 RN1.4
  Bottom 0.15: v13.7,19.12 13.55,19.12 13.08,18.65 13.08,12.7 14.16,11.62 X2.2
N$8
  Top 0.3: RN1.6 RN1.8 10.25,20.62 10.25,22.05 10.97,22.77 10.97,23.25 C13.2
N$23
  Top 0.15: U5.8 34.08,21.13 34.07,21.12 35.23,19.98 R6.1
N$24
  Top 0.15: R7.1 37.38,11.1 35.9,11.1 JP1.1
N$25
  Top 0.15: LED1.A 11.05,35.4 9.62,35.4 8.83,34.6 RN2.6
N$26
  Top 0.15: JP2.2 26.87,11.09 R8.1
N$29
  Top 0.15: LED2.A 12.4,35.1 9.78,35.1 9.33,34.65 9.33,34.35 8.78,33.8 RN2.8
OSC1
  Top 0.15: 16.9,17.35 16.92,17.35 17.88,18.3 17.88,19.62 18.12,19.88 U4.19 | C16.2 21.9,17.4 21,16.5 17.75,16.5 16.9,17.35 | Q1.1 16.9,17.35
OSC2
  Top 0.15: U4.20 18.77,19.35 Q1.3 C15.2
RBIAS
  Top 0.15: R5.2 12.85,23.85 13.3,24.3 U4.10
RS485A
  Top 0.15: D7.1 28.42,19.73 27.51,20.64 U6.7 27.5,21.6 27.5,22.48 27.32,22.65 25.82,22.65 25.52,22.35 25.52,12.58 | 24.62,9.75 24.62,9.7 | 24.62,9.75 24.62,11.7 25.52,12.6 25.52,12.58 | 25.52,12.58 R8.2 | X1.1 24.62,9.46 24.62,9.75
RS485B
  Top 0.15: U6.6 26.24,19.84 D7.2 26.52,19.35 25.9,18.73 25.9,13.88 26.88,12.9 29.02,12.9 JP2.1 | JP2.1 30.12,8.55 X1.2 | JP2.1
RS485RX
  Top 0.15: U3.27 39.67,23 39.17,22.5 36.92,22.5 33.77,25.65 29.57,25.65 28.78,26.45 U6.1
RS485TE
  Top 0.15: U3.29 39.67,21.4 39.17,21.9 36.62,21.9 33.48,25.05 27.65,25.05 26.22,26.48 U6.3
RS485TX
  Top 0.15: U3.28 36.77,22.2 33.62,25.35 27.8,25.35 26.85,26.3 26.85,27.93 26.62,28.15 25.52,28.15 24.97,27.59 U6.4
SCK  (via drill 0.3 pad 0.6)
  Top 0.15: v17.45,32.98 17.67,32.75 21.32,32.75 22.35,33.77 25.55,33.77 26.12,34.35 38.67,34.35 41.67,31.35 45.02,31.35 46.02,32.35 U3.11 46.02,33.2 47.77,34.95 v47.98,34.95 48.27,35.25 63.92,35.25 65.03,36.35 X3.45 | U4.4 17.47,26.77 17.72,27.02 v17.72,28.35 17.72,29.27 17.55,29.45 10.68,29.45 10.22,29 6.53,29 6.53,25.93 4.75,24.15 4.75,22.98 4.28,22.5 2.83,22.5 X6.13
  Bottom 0.15: v17.45,32.98 17.45,32.8 18.17,32.08 18.17,29.57 17.72,29.12 v17.72,28.35 | X4.3 51.95,11.65 50.9,12.7 48.32,12.7 47.73,13.3 47.73,14.38 49.15,15.8 49.15,19.55 47.88,20.82 47.88,34.85 v47.98,34.95
SHLD
  Top 0.8: X2.GND@2 18.03,5.7 18.02,5.7 19.09,6.77 C11.2
SW3
  Top 0.15: L2.1 L2A.2 | C8.1 72.48,28.27 72.48,23.57 72.48,23.55
  Top 0.4: L2.1 | L2.1 | U2.6 71.8,23.57 72.48,23.57 73.03,23.57 | 73.03,23.57 L2.1 | D4.C 73.03,23.57
SW5
  Top 0.15: 83.88,23.55 83.88,23.57 83.88,28.15 C4.1 | L1A.2 86.1,24.73 | L1A.2 | L1.1 86.1,23.57 L1A.2
  Top 0.4: D2.C 86.86,23.14 86.43,23.57 86.42,23.57 L1.1 86.09,23.57 | 86.09,23.57 86.1,23.57 | U1.6 83.07,23.57 83.88,23.57 86.09,23.57
TPIN+  (via drill 0.3 pad 0.6)
  Top 0.15: v11.68,21 RN1.5 11.68,22.1 12.12,22.55 12.12,25.93 12.45,26.25 13.15,26.25 14.45,24.95 U4.9
  Bottom 0.15: v11.68,21 12.18,20.5 12.18,11.82 X2.4
TPIN-  (via drill 0.3 pad 0.6)
  Top 0.15: v10.88,21 RN1.7 10.88,21.82 11.83,22.77 11.83,26.05 12.33,26.55 13.28,26.55 14.22,25.6 U4.8
  Bottom 0.15: v10.88,21 11.88,20 11.88,13.05 10.38,11.55 X2.6
TPOUT+  (via drill 0.3 pad 0.6)
  Top 0.15: U4.13 13.58,22.35 13.28,22.05 RN1.1 v13.28,21
  Bottom 0.15: v13.28,21 12.78,20.5 12.78,12.57 13.53,11.82 13.53,10.5 14.95,9.08 X2.1
TPOUT-  (via drill 0.3 pad 0.6)
  Top 0.15: U4.12 13.7,23 12.47,21.77 RN1.3 v12.47,21
  Bottom 0.15: X2.3 13.22,9.11 13.22,11.7 12.47,12.45 v12.47,21
VCAP
  Top 0.15: C14.2 21.95,23.65 U4.25
VETH+
  Top 0.8: X2.9 8,9 9.95,7.05 16.22,7.05 18.6,9.45 19.66,9.46 | 19.66,9.46 19.67,9.45 | 19.66,9.46 JP3.2
VETH-
  Top 0.8: X2.10 7.14,11.59 8.72,13.2 15.62,13.2 16.79,12.03 JP3.4 19.67,12
VIN
  Top 0.4: 81.08,18.1 81.48,18.1
  Top 0.8: X3.49 69.33,38.7 88.9,38.7 88.9,15.75 | 88.9,15.75 82.53,15.75 81.45,16.82 C3.2 | 88.9,15.75 88.9,1.27 24.17,1.27 22.93,2.52 22.92,8.72 JP3.1
  pour Top (rank 4): 82.68,15.43 82.68,24.15 80.58,24.15 80.58,22.5 77.58,22.5 77.58,19.2 78.33,19.2 82.05,15.43
VSUP
  Top 0.8: C1.2 78.68,17.7 D1.A 78.83,17.35 81.78,14.4 87.4,14.4 87.4,2.62 44.42,2.62 43.57,3.48 X1.6
XTAL1
  Top 0.15: U3.24 38.55,25.4 Q2.1 36.55,27.4 35.35,27.4 35.07,27.68 35.07,30.48 | 36,31.25 C18.2 35.85,31.25 35.07,30.48 | SJ1.2 34.84,30.24 35.07,30.48
XTAL2
  Top 0.15: U3.23 39.38,26.2 38.27,27.3 37.2,27.3 36.02,28.5 Q2.3 35.9,28.75 35.9,29.87 C17.2

### Text on the board
tStop: sautter.com